# Altium schematic sheet GPSDO_Controller.SchDoc: Controller
size 420 x 297 mm; EDA_Number: ARTIQ; Projet: GPSDO; Author: G.Kasprowicz; CompanyName: WUT ISE; DrawnBy: G.Kasprowicz; Organization: WUT ISE; Address1: PW ISE; Address2: Nowowiejska 15/19 00-665 Warsaw; Address3: gkasprow@gmail.com; Revision: 1; SheetNumber: -; SheetTotal: -; ModifiedBy: -; CheckedDate: -; DivGrp: WUT ISE; Designer: G.Kasprowicz; ModifiedDate: -; ProjectName: Sensor Box
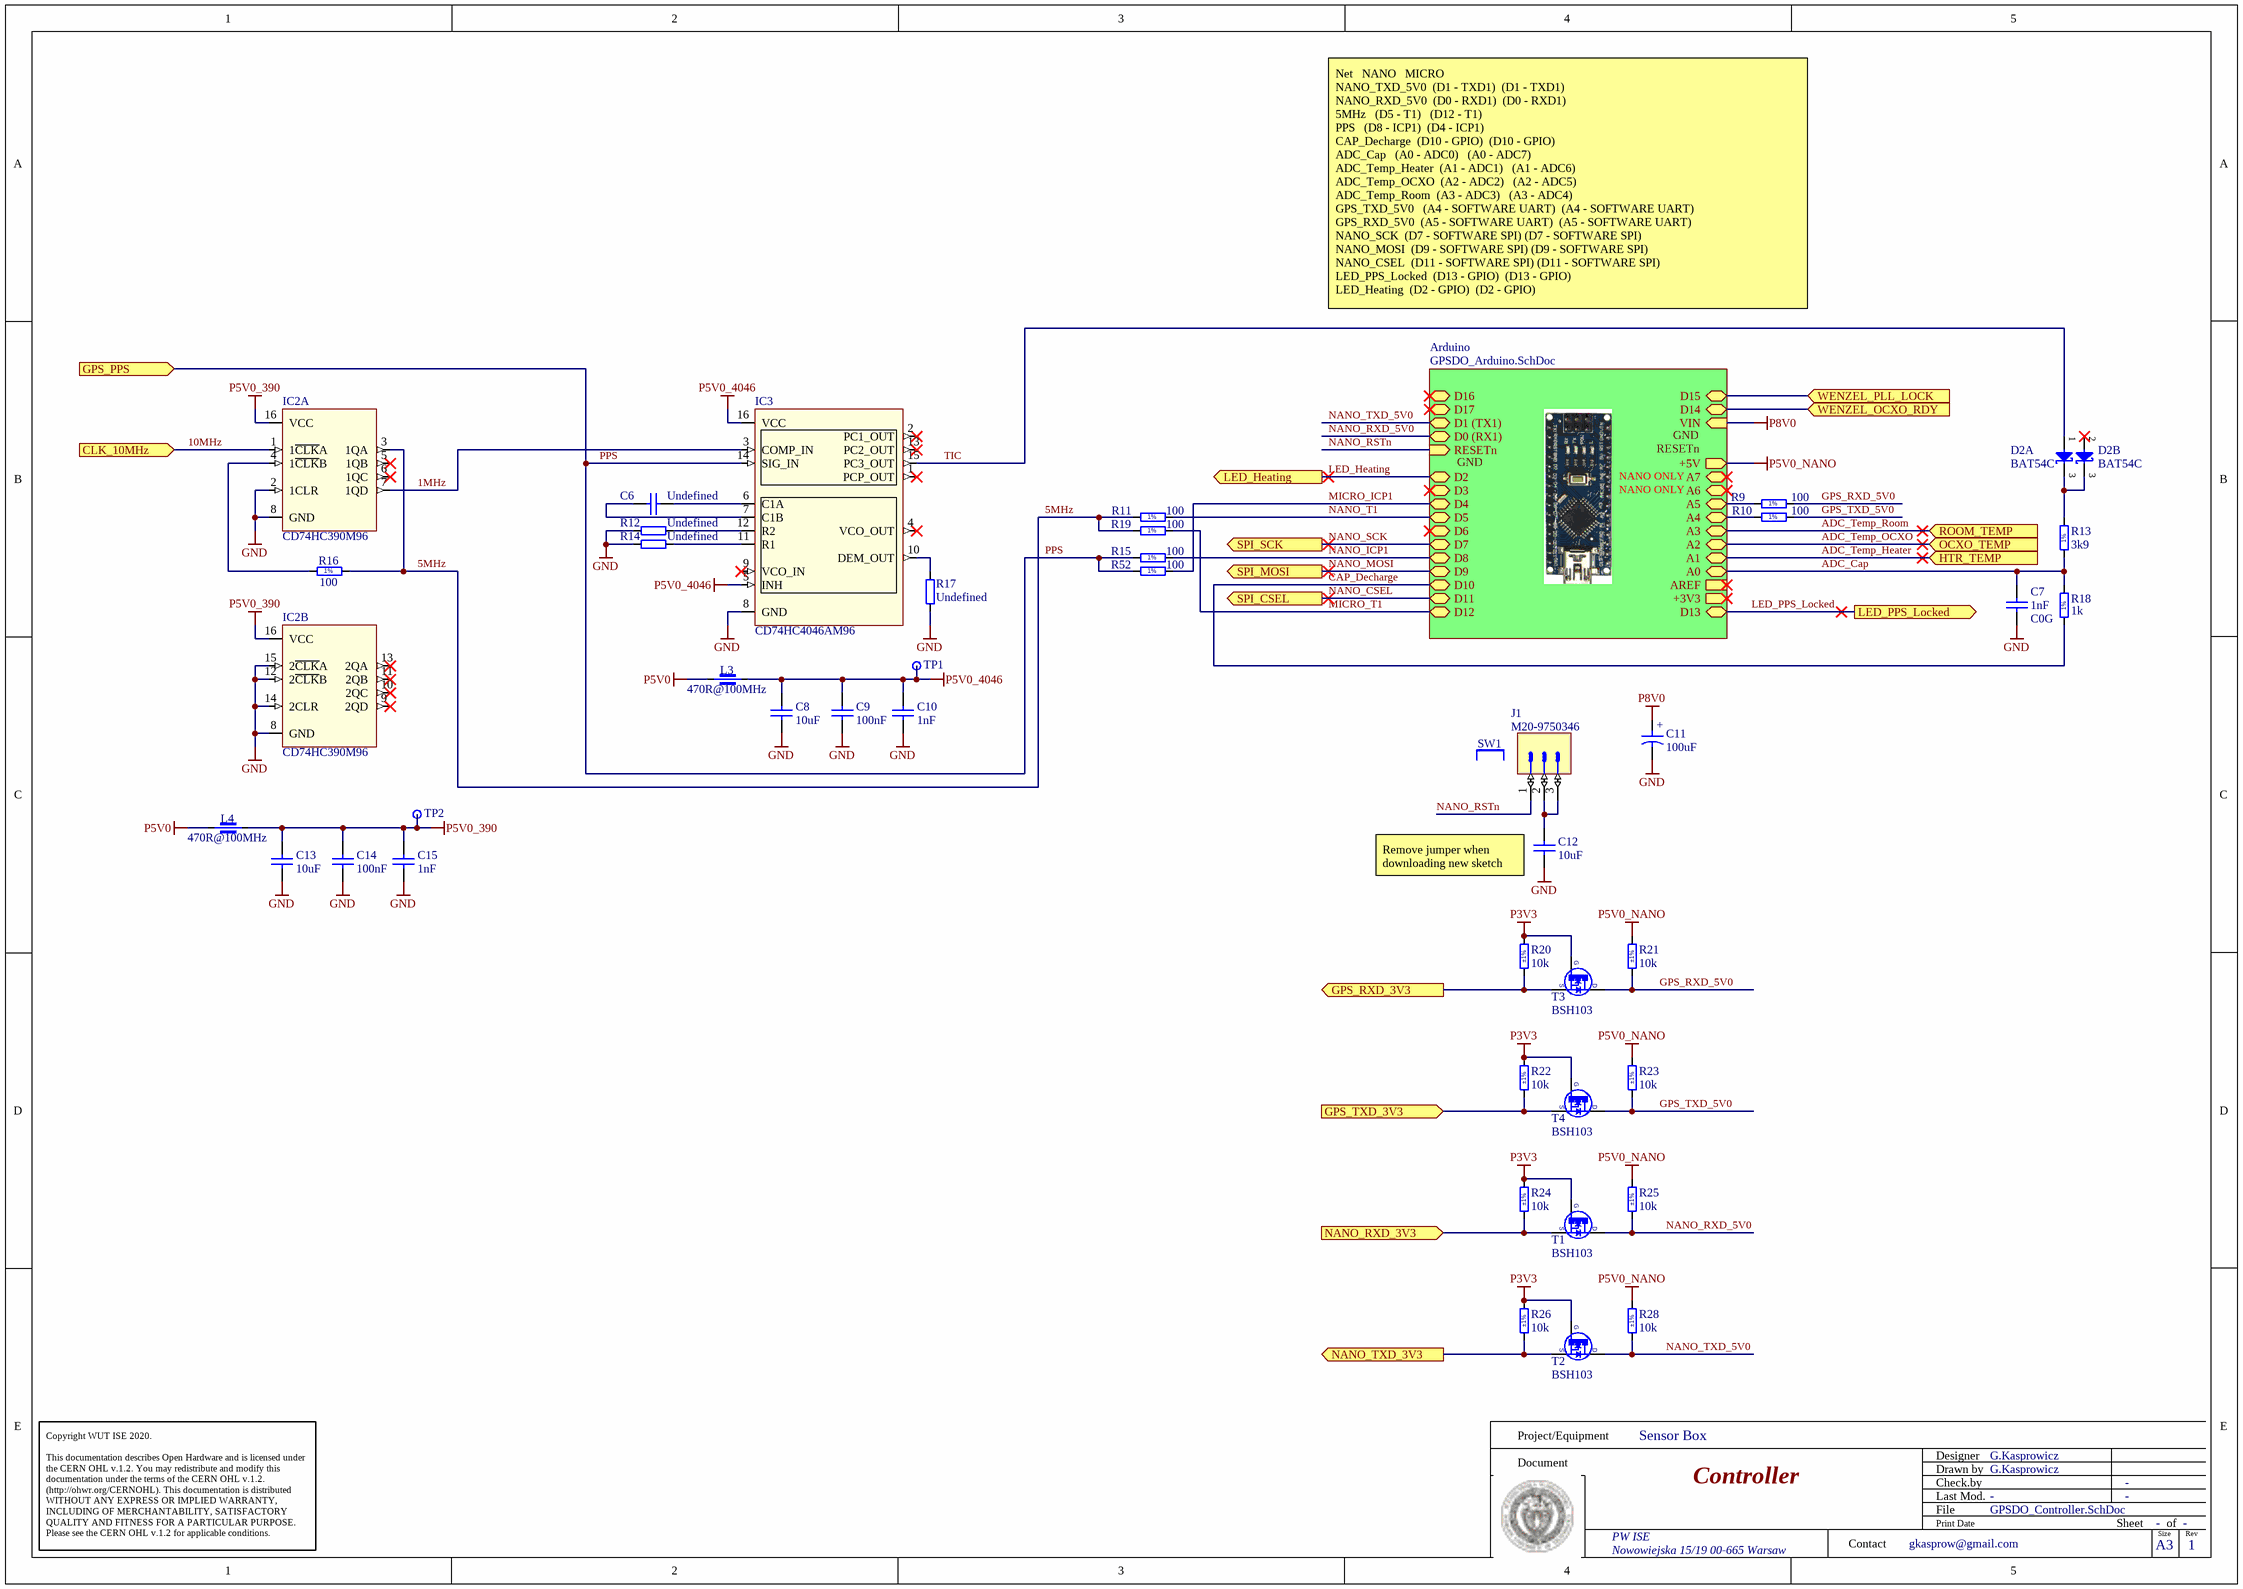
[diagram p0: GPSDO_Controller.SchDoc]

## Parts
C6  Undefined  [CAPC1005X55N]
C7  1nF  TC: C0G  [CAPC1608X90N]
C8  10uF  [CAPC1608X80N]
C9  100nF  [CAPC1005X55N]
C10  1nF  [CAPC1608X90N]
C11  100uF  [CAPMP7343X310N]
C12  10uF  [CAPC1608X80N]
C13  10uF  [CAPC1608X80N]
C14  100nF  [CAPC1005X55N]
C15  1nF  [CAPC1608X90N]
D2  BAT54C  [SOT95P240X130-3N]  (parts A,B of 2)
IC2  CD74HC390M96  [SOIC127P600X175-16N]  (parts A,B of 2)
IC3  CD74HC4046AM96  [SOIC127P600X175-16N]
J1  M20-9750346  [HARWIN_M20-9750346]
L3  470R@100MHz  [INDC1608X95N]
L4  470R@100MHz  [INDC1608X95N]
R9  100  [RESC1005X40N]
R10  100  [RESC1005X40N]
R11  100  [RESC1005X40N]
R12  Undefined  [RESC1005X40N]
R13  3k9  [RESC1005X40N]
R14  Undefined  [RESC1005X40N]
R15  100  [RESC1005X40N]
R16  100  [RESC1005X40N]
R17  Undefined  [RESC1005X40N]
R18  1k  [RESC1005X40N]
R19  100  [RESC1005X40N]
R20  10k  Tolerance: ±1%  [RESC1005X40N]
R21  10k  Tolerance: ±1%  [RESC1005X40N]
R22  10k  Tolerance: ±1%  [RESC1005X40N]
R23  10k  Tolerance: ±1%  [RESC1005X40N]
R24  10k  Tolerance: ±1%  [RESC1005X40N]
R25  10k  Tolerance: ±1%  [RESC1005X40N]
R26  10k  Tolerance: ±1%  [RESC1005X40N]
R28  10k  Tolerance: ±1%  [RESC1005X40N]
R52  100  [RESC1005X40N]
SW1  M7582-46  [HARWIN_M7582-46]  (value not drawn)
T1  BSH103  [SOT95P230X110-3N]
T2  BSH103  [SOT95P230X110-3N]
T3  BSH103  [SOT95P230X110-3N]
T4  BSH103  [SOT95P230X110-3N]
TP1  Test Point  [TPS127]  (value not drawn)  (no BOM)
TP2  Test Point  [TPS127]  (value not drawn)  (no BOM)

## Sub-sheets
Arduino = GPSDO_Arduino.SchDoc: D16 (bidir), D2 (bidir), D3 (bidir), D1 (TX1) (bidir), D17 (bidir), D7 (bidir), D8 (bidir), D9 (bidir), D14 (bidir), D11 (bidir), D0 (RX1) (bidir), D10 (bidir), D6 (bidir), D15 (bidir), D4 (bidir), D5 (bidir), D12 (bidir), A7 (bidir), D13 (bidir), +3V3 (out), +5V (out), AREF, A1 (bidir), A3 (bidir), A4 (bidir), A2 (bidir), VIN (in), RESETn (in), A6 (bidir), A5 (bidir), A0 (bidir)

## Ports
CLK_10MHz (in), GPS_PPS (in), GPS_RXD_3V3 (out), GPS_TXD_3V3 (in), HTR_TEMP (in), LED_Heating (out), LED_PPS_Locked (out), NANO_RXD_3V3 (in), NANO_TXD_3V3 (out), OCXO_TEMP (in), ROOM_TEMP (in), SPI_CSEL (out), SPI_MOSI (out), SPI_SCK (out), WENZEL_OCXO_RDY (in), WENZEL_PLL_LOCK (in)

## Nets
GND: C7.1 C8.1 C9.1 C10.1 C11.2 C12.1 C13.1 C14.1 C15.1 IC2.2(1CLR) IC2.8(GND) IC2.12(2~{CLK}B) IC2.14(2CLR) IC2.15(2~{CLK}A) IC3.8(GND) R12.1 R14.1 R17.1
P3V3: R20.2 R22.2 R24.2 R26.2 T1.1(G) T2.1(G) T3.1(G) T4.1(G)
P5V0: L3.1 L4.1
P5V0_390: C13.2 C14.2 C15.2 IC2.16(VCC) L4.2 TP2.1
P5V0_4046: C8.2 C9.2 C10.2 IC3.5(INH) IC3.16(VCC) L3.2 TP1.1
P5V0_NANO: R21.2 R23.2 R25.2 R28.2 ; sheet Arduino/+5V
P8V0: C11.1 ; sheet Arduino/VIN
1MHz: IC2.7(1QD) IC3.3(COMP_IN)
5MHz: IC2.3(1QA) R11.1 R16.2 R19.1
10MHz: IC2.1(1~{CLK}A) ; port CLK_10MHz
ADC_Cap: C7.2 R13.1 R18.2 ; sheet Arduino/A0
ADC_Temp_Heater: port HTR_TEMP, sheet Arduino/A1
ADC_Temp_OCXO: port OCXO_TEMP, sheet Arduino/A2
ADC_Temp_Room: port ROOM_TEMP, sheet Arduino/A3
CAP_Decharge: R18.1 ; sheet Arduino/D10
GPS_RXD_3V3: R20.1 T3.2(S) ; port GPS_RXD_3V3
GPS_RXD_5V0: R9.2 R21.1 T3.3(D)
GPS_TXD_3V3: R22.1 T4.2(S) ; port GPS_TXD_3V3
GPS_TXD_5V0: R10.2 R23.1 T4.3(D)
LED_Heating: port LED_Heating, sheet Arduino/D2
LED_PPS_Locked: port LED_PPS_Locked, sheet Arduino/D13
MICRO_ICP1: R52.2 ; sheet Arduino/D4
MICRO_T1: R19.2 ; sheet Arduino/D12
NANO_CSEL: port SPI_CSEL, sheet Arduino/D11
NANO_ICP1: R15.2 ; sheet Arduino/D8
NANO_MOSI: port SPI_MOSI, sheet Arduino/D9
NANO_RSTn: J1.1 ; sheet Arduino/RESETn
NANO_RXD_3V3: R24.1 T1.2(S) ; port NANO_RXD_3V3
NANO_RXD_5V0: R25.1 T1.3(D) ; sheet Arduino/D0 (RX1)
NANO_SCK: port SPI_SCK, sheet Arduino/D7
NANO_T1: R11.2 ; sheet Arduino/D5
NANO_TXD_3V3: R26.1 T2.2(S) ; port NANO_TXD_3V3
NANO_TXD_5V0: R28.1 T2.3(D) ; sheet Arduino/D1 (TX1)
PPS: IC3.14(SIG_IN) R15.1 R52.1 ; port GPS_PPS
TIC: D2.1(A) IC3.15(PC3_OUT)
WENZEL_OCXO_RDY: port WENZEL_OCXO_RDY, sheet Arduino/D14
WENZEL_PLL_LOCK: port WENZEL_PLL_LOCK, sheet Arduino/D15
NetC6_1: C6.1 IC3.7(C1B)
NetC6_2: C6.2 IC3.6(C1A)
NetC12_2: C12.2 J1.2 J1.3
NetD2_3: D2.3(COMC) R13.2
NetIC2_4: IC2.4(1~{CLK}B) R16.1
NetIC3_10: IC3.10(DEM_OUT) R17.2
NetIC3_11: IC3.11(R1) R14.2
NetIC3_12: IC3.12(R2) R12.2
NetR9_1: R9.1 ; sheet Arduino/A5
NetR10_1: R10.1 ; sheet Arduino/A4

Not connected (* = marked no-connect by the designer): D2 2(A)*; IC2 5(1QB)* 6(1QC)* 9(2QD)* 10(2QC)* 11(2QB)* 13(2QA)*; IC3 1(PCP_OUT)* 2(PC1_OUT)* 4(VCO_OUT)* 9(VCO_IN)* 13(PC2_OUT)*; SW1 1

## Notes on the sheet
- Net			NANO			MICRO
  NANO_TXD_5V0		(D1 - TXD1)		(D1 - TXD1)
  NANO_RXD_5V0		(D0 - RXD1)		(D0 - RXD1)
  5MHz			(D5 - T1)			(D12 - T1)
  PPS			(D8 - ICP1)		(D4 - ICP1)
  CAP_Decharge		(D10 - GPIO)		(D10 - GPIO)
  ADC_Cap			(A0 - ADC0) 		(A0 - ADC7)
  ADC_Temp_Heater		(A1 - ADC1) 		(A1 - ADC6)
  ADC_Temp_OCXO		(A2 - ADC2) 		(A2 - ADC5)
  ADC_Temp_Room		(A3 - ADC3) 		(A3 - ADC4)
  GPS_TXD_5V0 		(A4 - SOFTWARE UART) 	(A4 - SOFTWARE UART)
  GPS_RXD_5V0		(A5 - SOFTWARE UART) 	(A5 - SOFTWARE UART)
  NANO_SCK		(D7 - SOFTWARE SPI)	(D7 - SOFTWARE SPI)
  NANO_MOSI		(D9 - SOFTWARE SPI)	(D9 - SOFTWARE SPI)
  NANO_CSEL		(D11 - SOFTWARE SPI)	(D11 - SOFTWARE SPI)
  LED_PPS_Locked		(D13 - GPIO)		(D13 - GPIO)
  LED_Heating		(D2 - GPIO)		(D2 - GPIO)
- RESETn
- GND
- NANO ONLY
- (near C12) Remove jumper when downloading new sketch
- Project/Equipment
- Document
- Designer
- Drawn by
- Check.by
- Copyright WUT ISE 2020.
  This documentation describes Open Hardware and is licensed under the CERN OHL v.1.2. You may redistribute and modify this documentation under the terms of the CERN OHL v.1.2. (http://ohwr.org/CERNOHL). This documentation is distributed WITHOUT ANY EXPRESS OR IMPLIED WARRANTY, INCLUDING OF MERCHANTABILITY, SATISFACTORY QUALITY AND FITNESS FOR A PARTICULAR PURPOSE. Please see the CERN OHL v.1.2 for applicable conditions.
- Contact
- File
- Last Mod.
- Print Date
- Sheet
- Size
- A3
- of
- Rev
- (in symbol CTE7343-31_100UF_20V_10%) +
- (in symbol R0402_1K_1%_0.0625W_100PPM) 1%
- (in symbol R0402_3K9_1%_0.0625W_100PPM) 1%
- (in symbol R0402_100R_1%_0.0625W_100PPM) 1%

## Library data of the parts
C6 = CC0402_NO-VALUE: Non-polarised capacitor; Part Description: Reserved Footprint For 0402(1005) Chip Ceramic Capacitor; Mounted: No; Part Number: CC0402_NO-VALUE; Component Kind: Standard; Component Type: Standard; Pin Count: 2; Value: Undefined; Status: None; Manufacturer: Undefined; Manufacturer Part Number: CC0402_NO-VALUE; Case: 0402; Socket: No; SMD: Yes; Sense: No; Manufacturer1 ComponentHeight: 0.55mm; HelpURL: Undefined; Author: CERN DEM JLC; CreateDate: 14.01.2014; LatestRevisionDate: 14.01.2014
C7 = CC0603_1NF_50V_1%_NP0: Non-polarised capacitor; Part Description: SMD Multilayer Chip Ceramic Capacitor; Manufacturer: GENERIC; Manufacturer1 Part Number: 06035A102FAT2A; Voltage: 50V; Tolerance: ±1%; Part Number: CC0603_1NF_50V_1%_NP0; Component Kind: Standard; Component Type: Standard; Pin Count: 2; Value: 1nF; Status: None; Manufacturer Part Number: CC0603_1NF_50V_1%_NP0; Case: 0603; Mounted: Yes; Socket: No; SMD: Yes; Sense: No; Manufacturer1 Example: AVX; Manufacturer1 ComponentHeight: 0.9mm; HelpURL: \\cern.ch\dfs\Applications\Altium\Datasheets\CC0603_C0G_AVX.pdf; Author: CERN DEM JLC; CreateDate: 15/06/2017; LatestRevisionDate: 15/06/2017
C8 C12 C13 = CC0603_10UF_10V_10%_X5R: Non-polarised capacitor; Part Description: SMD Multilayer Chip Ceramic Capacitor; Manufacturer: GENERIC; Manufacturer1 Part Number: GRM188R61A106KE69D; Voltage: 10V; TC: X5R; Tolerance: ±10%; Part Number: CC0603_10UF_10V_10%_X5R; Component Kind: Standard; Component Type: Standard; Pin Count: 2; Value: 10uF; Status: None; Manufacturer Part Number: CC0603_10UF_10V_10%_X5R; Case: 0603; Mounted: Yes; Socket: No; SMD: Yes; Sense: No; Manufacturer1 Example: MURATA; Manufacturer1 ComponentHeight: 0.8mm; HelpURL: \\cern.ch\dfs\Applications\Altium\Datasheets\CC0603_MURATA_GRM188R61A106KE69D.pdf; Author: CERN DEM JLC; CreateDate: 31.01.2017; LatestRevisionDate: 31.01.2017
C9 C14 = CC0402_100NF_16V_10%_X5R: Non-polarised capacitor; Part Description: SMD Multilayer Chip Ceramic Capacitor; Manufacturer: GENERIC; Manufacturer1 Part Number: GRM155R61C104KA88D; Voltage: 16V; TC: X5R; Tolerance: ±10%; Part Number: CC0402_100NF_16V_10%_X5R; Component Kind: Standard; Component Type: Standard; Pin Count: 2; Value: 100nF; Status: None; Manufacturer Part Number: CC0402_100NF_16V_10%_X5R; Case: 0402; Mounted: Yes; Socket: No; SMD: Yes; Sense: No; Manufacturer1 Example: MURATA; Manufacturer1 ComponentHeight: 0.55mm; HelpURL: \\cern.ch\dfs\Applications\Altium\Datasheets\CC0402_X5R_MURATA_GRM.pdf; Author: CERN DEM JLC; CreateDate: 10.12.2013; LatestRevisionDate: 10.12.2013
C10 C15 = CC0603_1NF_50V_1%_NP0: Non-polarised capacitor; Part Description: SMD Multilayer Chip Ceramic Capacitor; Manufacturer: GENERIC; Manufacturer1 Part Number: 06035A102FAT2A; Voltage: 50V; TC: C0G; Tolerance: ±1%; Part Number: CC0603_1NF_50V_1%_NP0; Component Kind: Standard; Component Type: Standard; Pin Count: 2; Value: 1nF; Status: None; Manufacturer Part Number: CC0603_1NF_50V_1%_NP0; Case: 0603; Mounted: Yes; Socket: No; SMD: Yes; Sense: No; Manufacturer1 Example: AVX; Manufacturer1 ComponentHeight: 0.9mm; HelpURL: \\cern.ch\dfs\Applications\Altium\Datasheets\CC0603_C0G_AVX.pdf; Author: CERN DEM JLC; CreateDate: 15/06/2017; LatestRevisionDate: 15/06/2017
C11 = CTE7343-31_100UF_20V_10%: Polarised capacitor; Part Description: Solid Tantalum Chip Capacitor; Manufacturer: GENERIC; Manufacturer1 Part Number: TAJD107K020R; Voltage: 20V; Tolerance: ±10%; Part Number: CTE7343-31_100UF_20V_10%; Component Kind: Standard; Component Type: Standard; Pin Count: 2; Value: 100uF; Status: Preferred; Manufacturer Part Number: CTE7343-31_100UF_20V_10%; Case: D; Mounted: Yes; Socket: No; SMD: Yes; Sense: No; Manufacturer1 Example: AVX; Manufacturer1 ComponentHeight: 3.1mm; HelpURL: \\cern.ch\dfs\Applications\Altium\Datasheets\CTE_AVX_TAJ.pdf; Author: CERN DEM JLC; CreateDate: 03/12/2007; LatestRevisionDate: 03/12/2007
D2 = BAT54C: Dual Common Cathode Schottky Diodes; Part Description: Dual Common Cathode Small Signal Schottky Diode; Manufacturer: FAIRCHILD SEMICONDUCTOR; Voltage: 30V; Power: 200mA; PressFit: No; Bonding: No; Part Number: BAT54C; Component Kind: Standard; Component Type: Standard; Device: BAT54C; PackageDescription: SOT, 0.95mm Pitch; 3 Pin, 1.30mm W X 2.90mm L X 1.30mm H, IPC Medium Density; Manufacturer Part Number: BAT54C; Pin Count: 3; Case: SOT23-3; Mounted: Yes; Socket: No; SMD: Yes; Sense: No; ComponentHeight: 1.30mm; HelpURL: \\cern.ch\dfs\Applications\Altium\Datasheets\BAT54C.pdf; Author: CERN DEM JLC; CreateDate: 17/09/2009; LatestRevisionDate: 27/05/2010
IC2 = 74HC390: Manufacturer1: Texas Instruments; Part Number: CD74HC390M96; Manufacturer1 Part Number: CD74HC390M96
IC3 = 74HC4046A: Manufacturer1: Texas Instruments; Part Number: CD74HC4046AM96; Manufacturer1 Part Number: CD74HC4046AM96
J1 = Connector 3 Male_1: Connector 3 Male 2.54mm; Manufacturer: Harwin; Manufacturer Part Number: M20-9750346; Part Number: M20-9750346
L3 L4 = IND0603_MURATA_BLM18PG471SN1D: Part Description: SMD EMIFIL Chip Ferrite Bead; Manufacturer: MURATA; Power: 1A; Resistance: 0.2R; Tolerance: ±25%; Part Number: IND0603_MURATA_BLM18PG471SN1D; Component Kind: Standard; Component Type: Standard; Pin Count: 2; Value: 470R@100MHz; Manufacturer Part Number: BLM18PG471SN1D; Case: 0603; Mounted: Yes; Socket: No; SMD: Yes; Sense: No; ComponentHeight: 0.95mm; HelpURL: \\cern.ch\dfs\Applications\Altium\Datasheets\IND0603_MURATA_BLM18P.pdf; Author: CERN DEM BC; CreateDate: 17.02.2021; LatestRevisionDate: 17.02.2021
R9-R11 R15 R16 R19 R52 = R0402_100R_1%_0.0625W_100PPM: Resistor - 1%; Part Description: General Purpose Thick Film Chip Resistor; Manufacturer: GENERIC; Manufacturer1 Part Number: 232270671001L; TC: ±100ppm/°C; PressFit: No; Part Number: R0402_100R_1%_0.0625W_100PPM; Component Kind: Standard; Component Type: Standard; Pin Count: 2; Value: 100; Status: Not Recommended; Power: 0.0625W; Tolerance: ±1%; Manufacturer Part Number: R0402_100R_1%_0.0625W_100PPM; Case: 0402; Mounted: Yes; Sense: No; Socket: No; SMD: Yes; Manufacturer1 Example: YAGEO PHYCOMP; Manufacturer1 ComponentHeight: 0.4mm; HelpURL: \\cern.ch\dfs\Applications\Altium\Datasheets\R0402_Phycomp_RC0402.pdf; Author: CERN DEM JLC; CreateDate: 03.12.2007; LatestRevisionDate: 17.10.2012
R12 R14 R17 = R0402_NO-VALUE: Resistor; Part Description: Reserved Footprint For a 0402 (1005) Chip Resistor; Mounted: No; Part Number: R0402_NO-VALUE; Component Kind: Standard; Component Type: Standard; Pin Count: 2; Value: Undefined; Status: None; Manufacturer: Undefined; Manufacturer Part Number: R0402_NO-VALUE; Case: 0402; Sense: No; Socket: No; SMD: Yes; Manufacturer1 Example: Undefined; Manufacturer1 Part Number: Undefined; Manufacturer1 ComponentHeight: Undefined; HelpURL: Undefined; Author: CERN DEM JLC; CreateDate: 03.12.2007; LatestRevisionDate: 13.03.2008
R13 = R0402_3K9_1%_0.0625W_100PPM: Resistor - 1%; Part Description: General Purpose Thick Film Chip Resistor; Manufacturer: GENERIC; Manufacturer1 Part Number: 232270673902L; TC: ±100ppm/°C; PressFit: No; Part Number: R0402_3K9_1%_0.0625W_100PPM; Component Kind: Standard; Component Type: Standard; Pin Count: 2; Value: 3k9; Status: Not Recommended; Power: 0.0625W; Tolerance: ±1%; Manufacturer Part Number: R0402_3K9_1%_0.0625W_100PPM; Case: 0402; Mounted: Yes; Sense: No; Socket: No; SMD: Yes; Manufacturer1 Example: YAGEO PHYCOMP; Manufacturer1 ComponentHeight: 0.4mm; HelpURL: \\cern.ch\dfs\Applications\Altium\Datasheets\R0402_Phycomp_RC0402.pdf; Author: CERN DEM JLC; CreateDate: 03/12/2007; LatestRevisionDate: 17/10/2012
R18 = R0402_1K_1%_0.0625W_100PPM: Resistor - 1%; Part Description: General Purpose Thick Film Chip Resistor; Manufacturer: GENERIC; Manufacturer1 Part Number: 232270671002L; TC: ±100ppm/°C; Part Number: R0402_1K_1%_0.0625W_100PPM; Component Kind: Standard; Component Type: Standard; Pin Count: 2; Value: 1k; Status: Not recommended; Power: 0.0625W; Tolerance: ±1%; Manufacturer Part Number: R0402_1K_1%_0.0625W_100PPM; Case: 0402; Mounted: Yes; Sense: No; Socket: No; SMD: Yes; Manufacturer1 Example: YAGEO PHYCOMP; Manufacturer1 ComponentHeight: 0.4mm; HelpURL: \\cern.ch\dfs\Applications\Altium\Datasheets\R0402_Phycomp_RC0402.pdf; Author: CERN DEM JLC; CreateDate: 2007-12-03; LatestRevisionDate: 2012-10-17
R20-R26 R28 = R0402_10K_1%_0.0625W_100PPM: Resistor - 1%; Part Description: General Purpose Thick Film Chip Resistor; Manufacturer: GENERIC; Manufacturer1 Part Number: 232270671003L; TC: ±100ppm/°C; PressFit: No; Part Number: R0402_10K_1%_0.0625W_100PPM; Component Kind: Standard; Component Type: Standard; Pin Count: 2; Value: 10k; Status: Not Recommended; Power: 0.0625W; Manufacturer Part Number: R0402_10K_1%_0.0625W_100PPM; Case: 0402; Mounted: Yes; Sense: No; Socket: No; SMD: Yes; Manufacturer1 Example: YAGEO PHYCOMP; Manufacturer1 ComponentHeight: 0.4mm; HelpURL: \\cern.ch\dfs\Applications\Altium\Datasheets\R0402_Phycomp_RC0402.pdf; Author: CERN DEM JLC; CreateDate: 03.12.2007; LatestRevisionDate: 17.10.2012
SW1 = HARWIN_M7582-46: Jumper 1 Pin; Manufacturer: Harwin; Manufacturer Part Number: M7582-46; Part Number: M7582-46
T1-T4 = BSH103: N-CHANNEL MOSFET WITH DIODE; Part Description: 30V 850mA N-Channel Enhancement Mode Field-Effect Transistor; Manufacturer: NEXPERIA; PressFit: No; Bonding: No; Part Number: BSH103; Component Kind: Standard; Component Type: Standard; Device: BSH103; PackageDescription: SOT23, 3 pin, Pitch 0.95mm - 1.3mm W X 2.9mm L X 1.1mm H, IPC Medium Density; Manufacturer Part Number: BSH103; Pin Count: 3; Case: SOT23-3; Mounted: Yes; Socket: No; SMD: Yes; Sense: No; ComponentHeight: 1.1mm; HelpURL: \\cern.ch\dfs\Applications\Altium\Datasheets\BSH103.pdf; Author: CERN DEM JLC; CreateDate: 16.03.2010; LatestRevisionDate: 20.06.2017
TP1 TP2 = SMD_PAD_1.27X1.27MM: Part Description: 1.27mm x 1.27mm PCB Copper Area (SMD Test Point); Mounted: No; Part Number: SMD_PAD_1.27X1.27MM; Component Type: Standard (No BOM); Pin Count: 1; Family: Test Point; Socket: No; SMD: Yes; Sense: No; Status: None; ComponentHeight: 0mm; HelpURL: Undefined; Author: CERN DEM JLC; CreateDate: 12.01.2008; LatestRevisionDate: 12.01.2008; PackageDescription: 1.27mm x 1.27mm PCB Copper Area (SMD Test Point)